# EAGLE design LEDPowerTest (EAGLE 9.2.2)
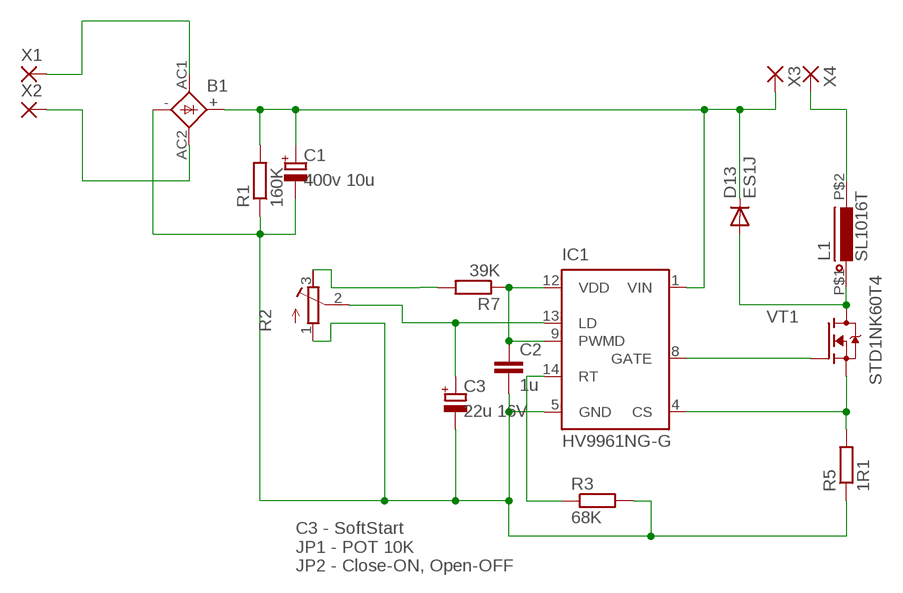
[diagram p0: schematic, sheet 1]

## Parts
B1  BRIDGEDBS  [DBS]
C1  400v 10u  CAP-POL_E3.5-8  [E3,5-8]
C2  1u  CAP_0805  [CAP0805]
C3  22u 16V  CAP-POL_3528  [CT3528]
D13  ES1J  DIODE_ES1J  [DO214AC]
IC1  HV9961NG-G  HV9910BNG  [SOIC-16NG]
L1  SL1016T  INDUCTORSL1016  [SL1016]
R1  160K  R_MF-0125  [MF-0125]
R2  R_POT3296X  [POT-3296X]
R3  68K  R_R0805  [RESC2012X50]
R5  1R1  R_MF-05  [MF-05]
R7  39K  R_R0805  [RESC2012X50]
VT1  STD1NK60T4  FET-NDPAK  [DPAK]
X1  WIREPAD-SMD2  [PAD-1.27X2.54]
X2  WIREPAD-SMD2  [PAD-1.27X2.54]
X3  WIREPAD-SMD2  [PAD-1.27X2.54]
X4  WIREPAD-SMD2  [PAD-1.27X2.54]

## Nets
N$2: R2.3(E) R7.2
N$3: C2.1 IC1.9(PWMD) IC1.12(VDD) R7.1
N$12: B1.AC1 X1.P$1(P)
N$13: B1.AC2 X2.P$1(P)
N$14: B1.- C1.- C2.2 C3.- IC1.5(GND) R1.1 R2.1(A) R3.2 R5.1
N$15: C3.+ IC1.13(LD) R2.2(S)
N$17: B1.+ C1.+ D13.C IC1.1(VIN) R1.2 X3.P$1(P)
N$19: IC1.4(CS) R5.2 VT1.S
N$20: IC1.14(RT) R3.1
N$21: IC1.8(GATE) VT1.G
N$22: L1.P$2 X4.P$1(P)
N$23: D13.A L1.P$1 VT1.D

## Notes on the sheet
- C3 - SoftStart
  JP1 - POT 10K
  JP2 - Close-ON, Open-OFF

## Library data of the parts
B1 = Flamberm:BRIDGE: GENERAL INSTRUMENT RECTIFIER
C1 C3 = Namenlos:CAP-POL_
C2 = Flamberm:CAP_
D13 = Flamberm:DIODE_
IC1 = Flamberm:HV9910B: Universal High Brightness LED Driver Source: www.supertex.com .. led_driver_ics_SG.pdf; OC_FARNELL: unknown; OC_NEWARK: unknown
L1 = Namenlos:INDUCTOR
R1 R3 R5 R7 = Flamberm:R_
R2 = Flamberm:R_POT
VT1 = Namenlos:FET-N
X1-X4 = Flamberm:WIREPAD-SMD2: SMD PAD

## Board
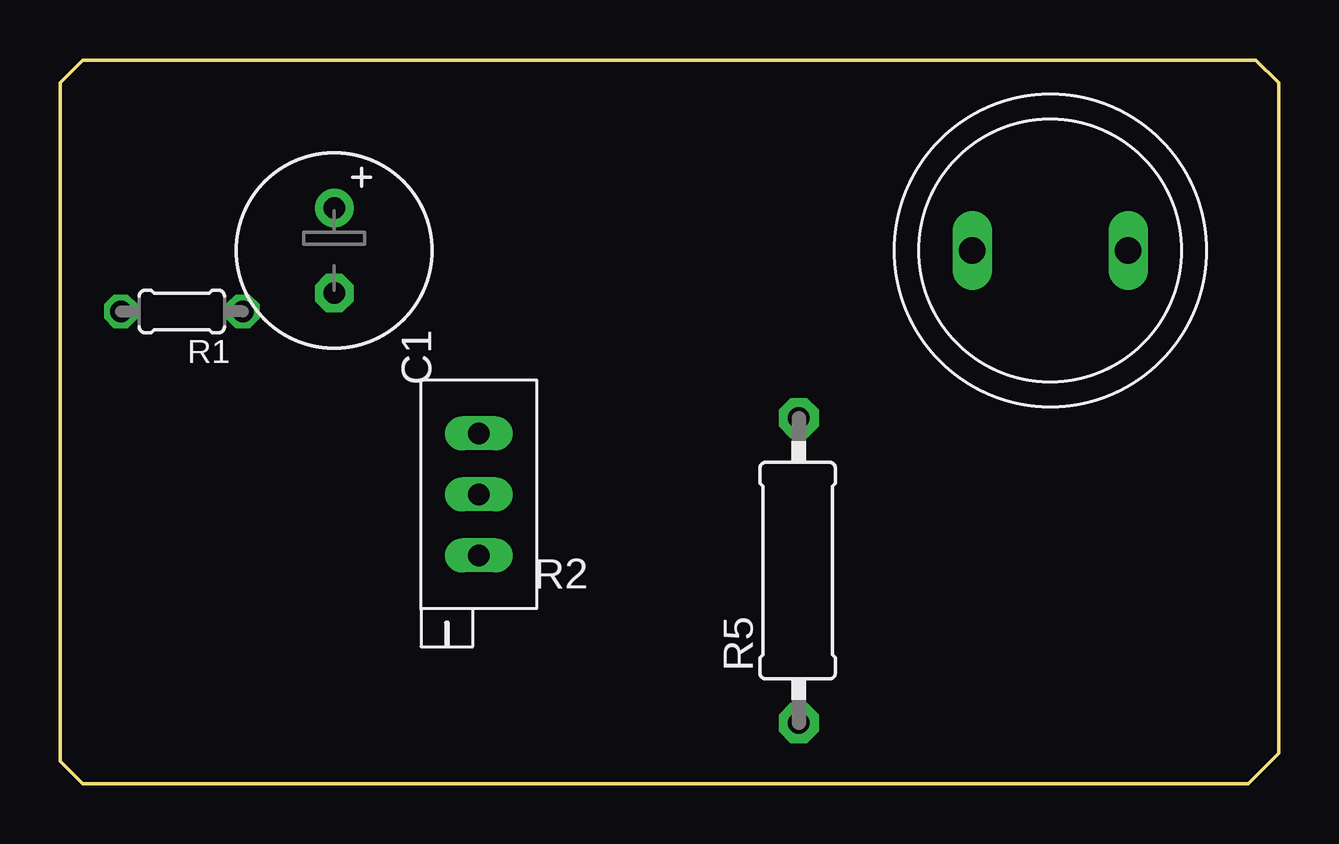
[diagram p1: board, top side]
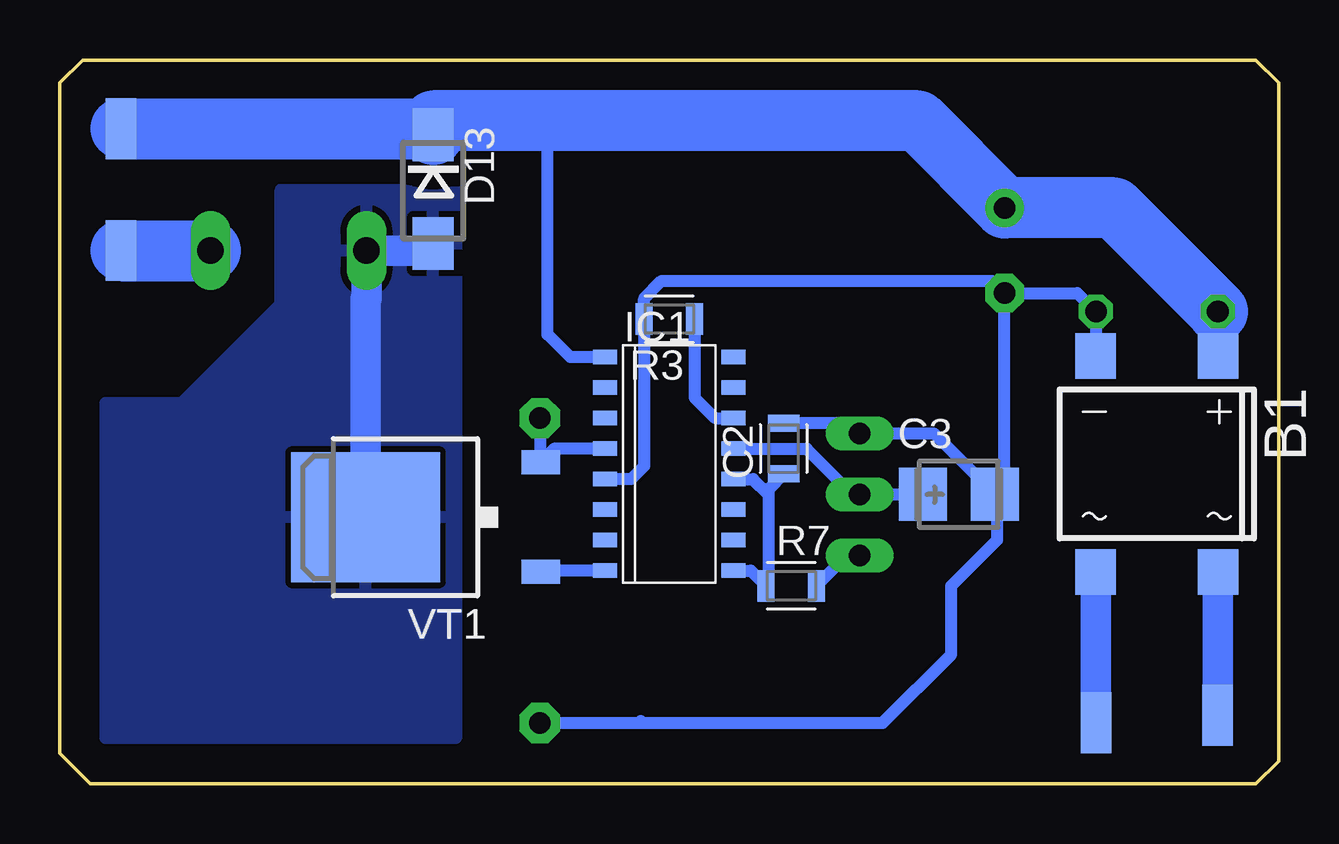
[diagram p2: board, bottom side, seen from below]

Size 50.8 x 30.16 mm. Coordinates in mm from the lower left corner, seen from the top.
Outline: 0.95,0 49.53,0 50.8,1.27 50.8,29.21 49.85,30.16 0.95,30.16 0,29.21 0,0.95 0.95,0
Copper layers (1*16): Top 0.035mm / dielectric 1.5mm / Bottom 0.035mm
Design rules "default": minimum track width 6mil, minimum drill 0.35mm, track to track 6mil, track to pad 6mil, pad to pad 6mil, via to via 6mil, smd to smd 6mil, copper to edge 40mil, drill to drill 6mil, minimum pad ring 10mil, minimum via ring 8mil, stop-mask expansion 4mil, vias tented up to drill 0mil, thermal gap 10mil

### Footprints (pad centres in the part's own frame; a part is rotated, then mirrored left to right if it is on the bottom)
DBS = smd 1.7 x 1.9: + -2.55,-4.5; - 2.55,-4.5; AC1 -2.55,4.5; AC2 2.55,4.5
E3,5-8 = drill 0.9 pad 1.6: + -1.778,0 | drill 0.9 pad 1.6 octagon: - 1.778,0
CAP0805 = smd 0.712 x 1.312: 1 -1.05,0; 2 1.05,0
CT3528 = smd 2 x 2.2: + -1.5,0; - 1.5,0
DO214AC = smd 2.2 x 1.7: A 2.25,0; C -2.285,0
SOIC-16NG = smd 0.6 x 1: 1 -4.445,-2.675; 2 -3.175,-2.675; 3 -1.905,-2.675; 4 -0.635,-2.675; 5 0.635,-2.675; 6 1.905,-2.675; 7 3.175,-2.675; 8 4.445,-2.675; 9 4.445,2.675; 10 3.175,2.675; 11 1.905,2.675; 12 0.635,2.675; 13 -0.635,2.675; 14 -1.905,2.675; 15 -3.175,2.675; 16 -4.445,2.675
SL1016 = drill 1.1 long: P$1 3.25,0; P$2 -3.25,0
MF-0125 = drill 0.9 octagon: 1 -2.54,0; 2 2.54,0
POT-3296X = drill 0.9 long: 1 0,-2.54; 2 0,0; 3 0,2.54
RESC2012X50 = smd 0.712 x 1.312: 1 -1.05,0; 2 1.05,0
MF-05 = drill 0.9 pad 1.676 octagon: 1 -6.35,0; 2 6.35,0
DPAK = smd 5.4 x 6.2: D 0,2.5 | smd 1 x 1.6: G -2.28,-4.8; S 2.28,-4.8
PAD-1.27X2.54 = smd 2.54 x 1.27: P$1 0,0

### Placement (x,y rotation side)
B1  5.08,13.34 180 bottom
C1  11.43,22.22 270 top
C2  20.64,13.97 90 bottom
C3  13.34,12.07 0 bottom
D13  35.24,24.77 270 bottom
IC1  25.4,13.34 270 bottom
L1  41.27,22.22 180 top
R1  5.08,19.68 180 top
R2  17.46,12.07 180 top
R3  25.4,19.37 180 bottom
R5  30.8,8.89 90 top
R7  20.32,8.25 0 bottom
VT1  35.56,11.11 90 bottom
X1  2.54,2.86 270 bottom
X2  7.62,2.54 270 bottom
X3  48.26,27.3 270 bottom
X4  48.26,22.22 270 bottom

### Tracks (layer width: path | path; a pad name or v marks a point on that pad's centre or on a via)
N$2
  Bottom 0.508: R2.3 18,9.52 R7.2
N$3
  Bottom 0.508: IC1.9 22.01,8.89 R7.1 21.27,8.35 21.27,12.07 | IC1.12 21.91,12.7 21.27,12.07 | C2.1 21.27,12.29 21.27,12.07
N$12
  Bottom 1.27: B1.AC1 X1.P$1
N$13
  Bottom 1.27: B1.AC2 X2.P$1
N$14
  Bottom 0.508: R5.1 26.67,2.54 | 26.67,2.54 16.51,2.54 13.65,5.4 13.65,8.25 11.75,10.16 11.75,11.98 C3.- | R1.1 | R1.1 B1.- | C1.- 8.4,20.45 R1.1 | 26.58,2.63 26.67,2.54 | C3.- 14.38,14.61 17.78,14.61 R2.1 17.88,15.02 C2.2 | IC1.5 26.99,12.7 26.45,13.24 R3.2 26.45,20.22 25.72,20.95 11.94,20.95 C1.- | C3.- 11.43,12.47 C1.-
N$15
  Bottom 0.508: 17.14,12.07 17.78,12.07 19.68,13.97 IC1.13 | 17.14,12.07 C3.+ | R2.2 17.14,12.07
N$17
  Bottom 0.508: R1.2 B1.+ | IC1.1 29.53,17.78 30.48,18.73 30.48,27.62
  Bottom 2.54: R1.2 6.86,24 C1.+ 15.05,27.62 30.48,27.62 35.24,27.62 D13.C 35.5,27.3 X3.P$1
N$19
  Bottom 0.406: 30.8,13.43 VT1.S
  Bottom 0.508: IC1.4 30.18,13.97 VT1.S | R5.2 30.8,13.43
N$20
  Bottom 0.508: R3.1 24.35,16.09 23.49,15.24 IC1.14
N$21
  Bottom 0.508: IC1.8 30.7,8.89 VT1.G
N$22
  Bottom 2.54: X4.P$1 L1.P$2
N$23
  Bottom 1.27: D13.A 35.53,22.22 L1.P$1 38.02,20.25 38.06,20.21 VT1.D
  pour Bottom (isolate 1.016): 34.29,24.77 34.29,1.91 48.9,1.91 48.9,15.88 45.72,15.88 41.59,20 41.59,24.77